# Altium schematic sheet sd_card.SchDoc
size A4; SheetNumber: 6; SheetTotal: 9
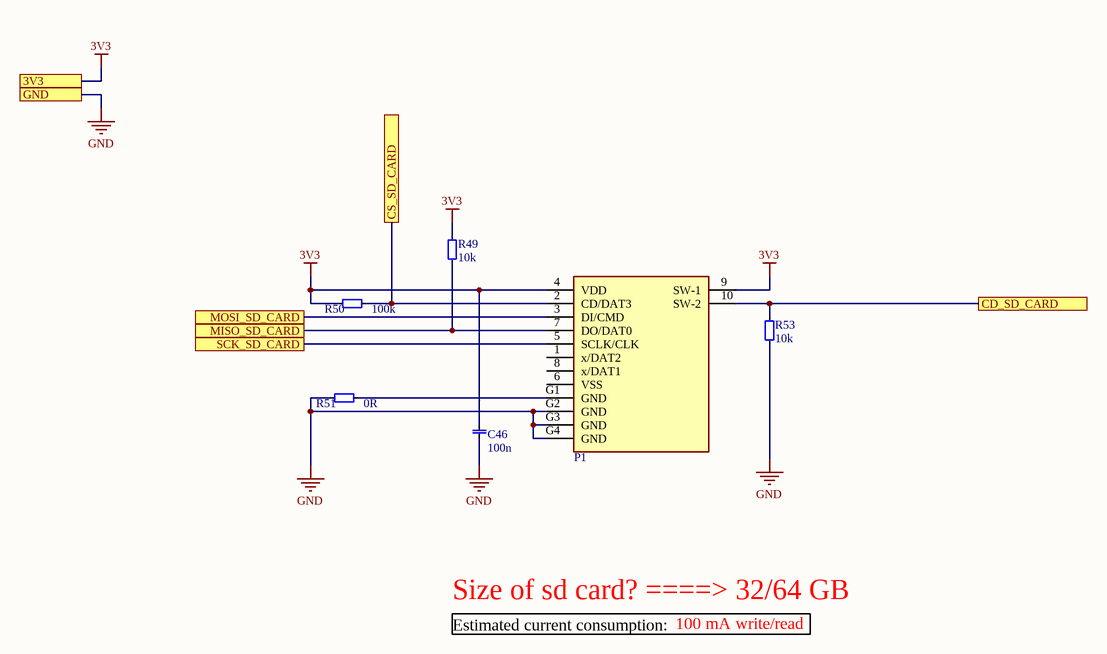
[diagram p0: sd_card.SchDoc]

## Parts
C46  value 100n  [0402 CAP]  (hidden comment: 0603, capacitor)
P1  SD Card connector  [MOLEX_104031-0811]  (value not drawn)
R49  value 10k  [0402 res]  (hidden comment: 0603, resistor)
R50  value 100k  [0402 res]  (hidden comment: 0603, resistor)
R51  value 0R  [0402 res]  (hidden comment: 0603, resistor)
R53  value 10k  [0402 res]  (hidden comment: 0603, resistor)

## Ports
3V3, CD_SD_CARD, CS_SD_CARD, GND, MISO_SD_CARD, MOSI_SD_CARD, SCK_SD_CARD

## Nets
3V3: C46.1 P1.4(VDD) P1.9(SW-1) R49.0 R50.0 ; port 3V3
GND: C46.0 P1.G2(GND) P1.G3(GND) P1.G4(GND) R51.0 R53.1 ; port GND
CD_SD_CARD: P1.10(SW-2) R53.0 ; port CD_SD_CARD
CS_SD_CARD: P1.2(CD/DAT3) R50.1 ; port CS_SD_CARD
MISO_SD_CARD: P1.7(DO/DAT0) R49.1 ; port MISO_SD_CARD
MOSI_SD_CARD: P1.3(DI/CMD) ; port MOSI_SD_CARD
SCK_SD_CARD: P1.5(SCLK/CLK) ; port SCK_SD_CARD
NetP1_G1: P1.G1(GND) R51.1

Not connected (* = marked no-connect by the designer): P1 1(x/DAT2) 6(VSS) 8(x/DAT1)

## Notes on the sheet
- Size of sd card? ====> 32/64 GB
- Estimated current consumption:
- 100 mA write/read

## Library data of the parts
C46 = 0603, capacitor: Manufacturer Part No: GRM155R62A104KE14D; Order number: *
P1 = SD Card connector: SD Card connector - SD Card connector; Manufacturer Part No: 1040310811; Value: SD Card Connector
R49 R53 = 0603, resistor: Manufacturer Part No: 311-10.0KLRCT-ND
R50 = 0603, resistor: Manufacturer Part No: RC0402FR-07100KL
R51 = 0603, resistor: Manufacturer Part No: RMCF0402ZT0R00